# Altium schematic sheet MRWOLF.SchDoc: WMI (MR.WOLF)
size A4; Author: MARCO; DrawnBy: MARCO; ProjectName: WOLF-MAN-INTERFACE
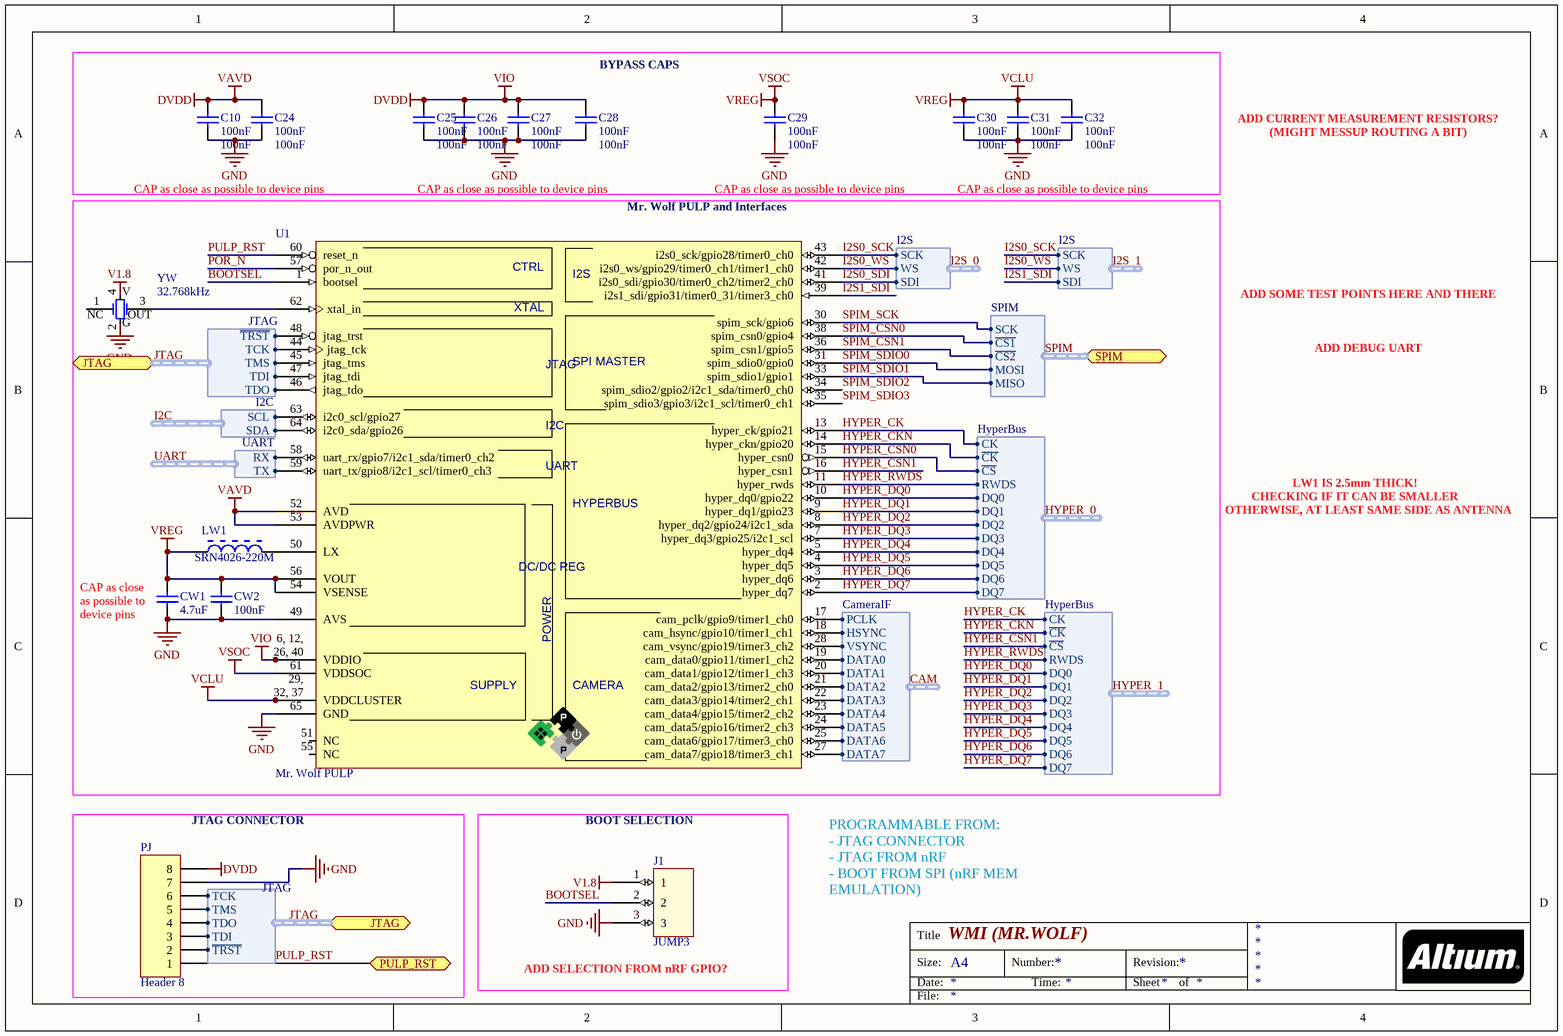
[diagram p0: MRWOLF.SchDoc]

## Parts
C10  100nF  [0402]
C24  100nF  [0402]
C25  100nF  [0402]
C26  100nF  [0402]
C27  100nF  [0402]
C28  100nF  [0402]
C29  100nF  [0402]
C30  100nF  [0402]
C31  100nF  [0402]
C32  100nF  [0402]
CW1  4.7uF  [0402]
CW2  100nF  [0402]
J1  JUMP3  [JMP3]
LW1  SRN4026-220M  [BOUR-IND-SRN4026]
PJ  Header 8  [HEADER8]
U1  Mr. Wolf PULP  [QFN50P900X900X100_HS_NOVIAS_65M]
YW  32.768kHz  [SiT1533-C]

## Blocks framed on the sheet
BYPASS CAPS: C10 C24-C32
Mr. Wolf PULP and Interfaces: CW1 CW2 LW1 U1 YW
JTAG CONNECTOR: PJ

## Ports
JTAG (harness JTAG), PULP_RST (bidir), SPIM (harness SPIM)

## Harnesses
JTAG: ~{TRST}, TCK, TMS, TDI, TDO
HyperBus: CK, ~{CK}, ~{CS}, RWDS, DQ0, DQ1, DQ2, DQ3, DQ4, DQ5, DQ6, DQ7
I2C: SCL, SDA
UART: RX, TX
I2S: SCK, WS, SDI
SPIM: SCK, ~{CS1}, ~{CS2}, MOSI, MISO
CameraIF: PCLK, HSYNC, VSYNC, DATA0, DATA1, DATA2, DATA3, DATA4, DATA5, DATA6, DATA7

## Nets
DVDD: C10.2 C24.2 C25.2 C26.2 C27.2 C28.2 PJ.8 U1.6(VDDIO) U1.12(VDDIO) U1.26(VDDIO) U1.40(VDDIO) U1.52(AVD) U1.53(AVDPWR)  [also labelled VAVD, VIO]
GND: C10.1 C24.1 C25.1 C26.1 C27.1 C28.1 C29.1 C30.1 C31.1 C32.1 CW1.1 CW2.1 J1.3 PJ.7 U1.49(AVS) U1.65(GND) YW.2(GND)
V1.8: J1.1 YW.4(VDD)
VCLU: C29.2 C30.2 C31.2 C32.2 CW1.2 CW2.2 LW1.1 U1.29(VDDCLUSTER) U1.32(VDDCLUSTER) U1.37(VDDCLUSTER) U1.54(VSENSE) U1.56(VOUT) U1.61(VDDSOC)  [also labelled VREG, VSOC]
BOOTSEL: J1.2 U1.1(bootsel)
CAM.DATA0: U1.19(cam_data0/gpio11/timer1_ch2) ; harness CameraIF.DATA0
CAM.DATA1: U1.20(cam_data1/gpio12/timer1_ch3) ; harness CameraIF.DATA1
CAM.DATA2: U1.21(cam_data2/gpio13/timer2_ch0) ; harness CameraIF.DATA2
CAM.DATA3: U1.22(cam_data3/gpio14/timer2_ch1) ; harness CameraIF.DATA3
CAM.DATA4: U1.23(cam_data4/gpio15/timer2_ch2) ; harness CameraIF.DATA4
CAM.DATA5: U1.24(cam_data5/gpio16/timer2_ch3) ; harness CameraIF.DATA5
CAM.DATA6: U1.25(cam_data6/gpio17/timer3_ch0) ; harness CameraIF.DATA6
CAM.DATA7: U1.27(cam_data7/gpio18/timer3_ch1) ; harness CameraIF.DATA7
CAM.HSYNC: U1.18(cam_hsync/gpio10/timer1_ch1) ; harness CameraIF.HSYNC
CAM.PCLK: U1.17(cam_pclk/gpio9/timer1_ch0) ; harness CameraIF.PCLK
CAM.VSYNC: U1.28(cam_vsync/gpio19/timer3_ch2) ; harness CameraIF.VSYNC
HYPER_CK: U1.13(hyper_ck/gpio21) ; harness HyperBus.CK  [project net HYPER_0.CK]
HYPER_CKN: U1.14(hyper_ckn/gpio20) ; harness HyperBus.~{CK}  [project net HYPER_0.~{CK}]
HYPER_CSN0: U1.15(hyper_csn0) ; harness HyperBus.~{CS}  [project net HYPER_0.~{CS}]
HYPER_CSN1: U1.16(hyper_csn1) ; harness HyperBus.~{CS}  [project net HYPER_1.~{CS}]
HYPER_DQ0: U1.10(hyper_dq0/gpio22) ; harness HyperBus.DQ0  [project net HYPER_0.DQ0]
HYPER_DQ1: U1.9(hyper_dq1/gpio23) ; harness HyperBus.DQ1  [project net HYPER_0.DQ1]
HYPER_DQ2: U1.8(hyper_dq2/gpio24/i2c1_sda) ; harness HyperBus.DQ2  [project net HYPER_0.DQ2]
HYPER_DQ3: U1.7(hyper_dq3/gpio25/i2c1_scl) ; harness HyperBus.DQ3  [project net HYPER_0.DQ3]
HYPER_DQ4: U1.5(hyper_dq4) ; harness HyperBus.DQ4  [project net HYPER_0.DQ4]
HYPER_DQ5: U1.4(hyper_dq5) ; harness HyperBus.DQ5  [project net HYPER_0.DQ5]
HYPER_DQ6: U1.3(hyper_dq6) ; harness HyperBus.DQ6  [project net HYPER_0.DQ6]
HYPER_DQ7: U1.2(hyper_dq7) ; harness HyperBus.DQ7  [project net HYPER_0.DQ7]
HYPER_RWDS: U1.11(hyper_rwds) ; harness HyperBus.RWDS  [project net HYPER_0.RWDS]
I2C.SCL: U1.63(i2c0_scl/gpio27) ; harness I2C.SCL
I2C.SDA: U1.64(i2c0_sda/gpio26) ; harness I2C.SDA
I2S0_SCK: U1.43(i2s0_sck/gpio28/timer0_ch0) ; harness I2S.SCK
I2S0_SDI: U1.41(i2s0_sdi/gpio30/timer0_ch2/timer2_ch0) ; harness I2S.SDI
I2S0_WS: U1.42(i2s0_ws/gpio29/timer0_ch1/timer1_ch0) ; harness I2S.WS
I2S1_SDI: U1.39(i2s1_sdi/gpio31/timer0_31/timer3_ch0) ; harness I2S.SDI
JTAG.~{TRST}: PJ.2 U1.48(jtag_trst) ; port JTAG.~{TRST}
JTAG.TCK: PJ.6 U1.44(jtag_tck) ; port JTAG.TCK
JTAG.TDI: PJ.3 U1.47(jtag_tdi) ; port JTAG.TDI
JTAG.TDO: PJ.4 U1.46(jtag_tdo) ; port JTAG.TDO
JTAG.TMS: PJ.5 U1.45(jtag_tms) ; port JTAG.TMS
POR_N: U1.57(por_n_out)
PULP_RST: PJ.1 U1.60(reset_n) ; port PULP_RST
SPIM_CSN0: U1.38(spim_csn0/gpio4) ; port SPIM.~{CS1}  [project net SPIM.~{CS1}]
SPIM_CSN1: U1.36(spim_csn1/gpio5) ; port SPIM.~{CS2}  [project net SPIM.~{CS2}]
SPIM_SCK: U1.30(spim_sck/gpio6) ; port SPIM.SCK  [project net SPIM.SCK]
SPIM_SDIO0: U1.31(spim_sdio0/gpio0) ; port SPIM.MOSI  [project net SPIM.MOSI]
SPIM_SDIO1: U1.33(spim_sdio1/gpio1) ; port SPIM.MISO  [project net SPIM.MISO]
SPIM_SDIO2: U1.34(spim_sdio2/gpio2/i2c1_sda/timer0_ch0)
SPIM_SDIO3: U1.35(spim_sdio3/gpio3/i2c1_scl/timer0_ch1)
UART.RX: U1.58(uart_rx/gpio7/i2c1_sda/timer0_ch2) ; harness UART.RX
UART.TX: U1.59(uart_tx/gpio8/i2c1_scl/timer0_ch3) ; harness UART.TX
NetLW1_2: LW1.2 U1.50(LX)
NetU1_62: U1.62(xtal_in) YW.3(OUT)

Not connected (* = marked no-connect by the designer): U1 51(NC) 55(NC); YW 1(NC)

## Buses and harness runs
harness JTAG = port JTAG
harness SPIM = port SPIM

## Notes on the sheet
- ADD CURRENT MEASUREMENT RESISTORS?
- (MIGHT MESSUP ROUTING A BIT)
- CAP as close as possible to device pins
- ADD SOME TEST POINTS HERE AND THERE
- ADD DEBUG UART
- LW1 IS 2.5mm THICK!
- CHECKING IF IT CAN BE SMALLER
- OTHERWISE, AT LEAST SAME SIDE AS ANTENNA
- (near CW1) CAP as close as possible to device pins
- BOOT SELECTION
- PROGRAMMABLE FROM:
  - JTAG CONNECTOR
  - JTAG FROM nRF
  - BOOT FROM SPI (nRF MEM EMULATION)
- (near J1) ADD SELECTION FROM nRF GPIO?
- Title
- Size:
- Date:
- A4
- Number:
- Time:
- Revision:
- Sheet
- of
- File:
- (in symbol PULP_MR_WOLF) CTRL; I2S; XTAL; JTAG; SPI MASTER; I2C; UART; HYPERBUS; DC/DC REG; POWER; 6, 12,; 26, 40; 29,; SUPPLY; CAMERA; 32, 37
- (in symbol SIT-OSC32KHZ-SIT1533AC-H5-DCC-32.768) V; G

## Library data of the parts
C10 C24-C32 = Cap Semi: Capacitor (Semiconductor SIM Model); Published: 8-Jun-2000; LatestRevisionDate: 29-May-2009; LatestRevisionNote: IPC-7351 Footprint Added.; PackageReference: C1206; Publisher: Altium Limited; PackageDescription: Chip Capacitor; Value: 100nF
CW1 CW2 = Cap Semi: Capacitor (Semiconductor SIM Model); Value: 100pF; Published: 8-Jun-2000; LatestRevisionDate: 29-May-2009; LatestRevisionNote: IPC-7351 Footprint Added.; PackageReference: C1206; Publisher: Altium Limited; PackageDescription: Chip Capacitor
LW1 = BOUR-IND-SRN4026-220M: Semi-shielded Power Inductor, 22uH, 3A; Manufacturer: Bourns; Core Material: Ferrite; Tolerance: 20%; Current Rating: 670mA; DC Resistance (DCR): 234mR; Self Resonant Frequency: 16MHz; Test Frequency: 100kHz; ComponentLink1URL: https://www.bourns.com/docs/Product-Datasheets/SRN4026.pdf; ComponentLink1Description: Datasheet; Supplier 1: RSComponents; Supplier Part Number 1: 813-5643P; Manufacturer Part Number: SRN4026-220M; Stock 1: 2770; Pricing 1: 100=0.209, 500=0.176, 3000=0.135, 6000=0.132 (EUR); Mount: Surface Mount; Case/Package: Nonstandard; Weight: 0.004938oz; Min Operating Temperature: -40°C; Max Operating Temperature: 125°C; Packaging: Tape and Reel; Composition: Wirewound; Inductance: 22uh; Saturation Current: 670mA; Shielding: Shielded; Max DC Current: 670mA; Termination: SMD/SMT; RMS Current (Irms): 670mA; Inductance Tolerance: 20%; Package Quantity: 3000; Length: 4mm; Height: 2.5mm; Width: 4mm; Height - Seated (Max): 0.098inch; Depth: 4mm; REACH SVHC: No SVHC; ComponentLink2URL: https://datasheet.ciiva.com/48684/srn4026-48684665.pdf; ComponentLink2Description: https://datasheet.ciiva.com/48684/srn4026-48684665.pdf; ComponentLink3URL: https://datasheet.ciiva.com/46641/70371276-46641103.pdf; ComponentLink3Description: https://datasheet.ciiva.com/46641/70371276-46641103.pdf; Supplier 2: Farnell; Supplier Part Number 2: 2428221; Stock 2: 402; Pricing 2: 5=0.298, 50=0.217, 250=0.175, 500=0.16, 1500=0.155, 3000=0.151, 15000=0.146 (EUR); Supplier 3: Digi-Key; Supplier Part Number 3: SRN4026-220MTR-ND; Stock 3: 0; Pricing 3: 3000=0.144, 6000=0.1395, 15000=0.135, 30000=0.133 (USD); Supplier 4: Digi-Key; Supplier Part Number 4: SRN4026-220MDKR-ND; Stock 4: 863; Pricing 4: 1=0.41, 10=0.362, 100=0.2588, 500=0.2174, 1000=0.176 (USD); Supplier 5: Mouser; Supplier Part Number 5: 652-SRN4026-220M; Stock 5: 140; Pricing 5: 1=0.36, 10=0.246, 50=0.246, 100=0.224, 1000=0.152, 10000=0.122 (USD); Supplier 6: Digi-Key; Supplier Part Number 6: SRN4026-220MCT-ND; Stock 6: 863; Pricing 6: 1=0.41, 10=0.362, 100=0.2588, 500=0.2174, 1000=0.176 (USD); Supplier 7: RSComponents; Supplier Part Number 7: 8135643; Stock 7: 1990; Pricing 7: 10=0.227, 100=0.216, 500=0.19, 3000=0.13, 6000=0.12 (GBP); Supplier 8: Distrelec; Supplier Part Number 8: SRN4026-220M; Stock 8: 3000; Pricing 8: 1=0.6667, 10=0.5, 100=0.3333, 500=0.2857 (EUR); Supplier 9: Farnell; Supplier Part Number 9: 2428221RL; Stock 9: 930; Pricing 9: 50=0.209, 250=0.165, 500=0.15, 1500=0.122, 3000=0.117, 15000=0.106, 30000=0.104 (GBP); Supplier 10: Distrelec; Supplier Part Number 10: 30026188; Stock 10: 2895; Pricing 10: 1=0.214, 10=0.1299, 50=0.1266, 250=0.1203, 500=0.1173, 2500=0.1145 (EUR); Supplier 11: RSComponents; Supplier Part Number 11: 813-5643; Stock 11: 2000; Pricing 11: 10=0.227, 100=0.216 (GBP)
PJ = Header 8: Header, 8-Pin; LatestRevisionDate: 17-Jul-2002; LatestRevisionNote: Re-released for DXP Platform.; Publisher: Altium Limited
U1 = PULP_MR_WOLF: Mr. Wolf PULP Heterogeneous Multi-Core System-On-Chip; Manufacturer: Aries Alectronics Inc.; Manufacturer Part Num: 23017; Part Class: Connectors; .checked_Footprint: 140604-11/scd; Num Pins: 64 (+9)
YW = SIT-OSC32KHZ-SIT1533AC-H5-DCC-32.768: 20 ppm, Ultra-Low Power 32.768 kHz Quartz XTAL Replacement; Current - Supply (max): 1.3uA; ComponentLink1URL: http://www.sitime.com/products/datasheets/sit1533/SiT1533-datasheet.pdf; ComponentLink1Description: Datasheet; Frequency: 32.768kHz; Supplier 1: Digi-Key; Supplier Part Number 1: 1473-1515-2-ND; Supplier 2: Digi-Key; Supplier Part Number 2: 1473-1515-1-ND; Supplier 3: Digi-Key; Supplier Part Number 3: 1473-1515-6-ND; Supplier 4: Digi-Key; Supplier Part Number 4: 1473-1516-2-ND; Supplier 5: Digi-Key; Supplier Part Number 5: 1473-1516-1-ND; Supplier 6: Digi-Key; Supplier Part Number 6: 1473-1516-6-ND; Supplier 7: Digi-Key; Supplier Part Number 7: SIT1533AC-H5-DCC-32.768S-ND; Supplier 8: Digi-Key; Supplier Part Number 8: SIT1533AC-H5-DCC-32.768D-ND